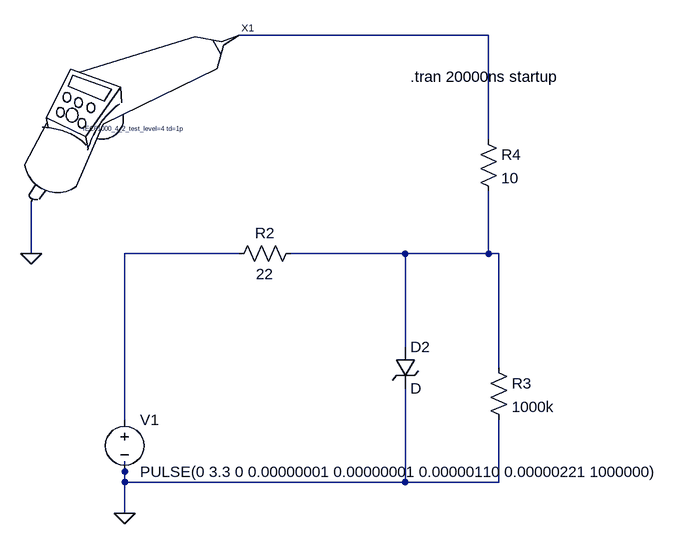
[diagram p0: schematic Draft1.asc]
Draft1.asc, the LTspice schematic file:
Version 4.1
SHEET 1 1024 852
WIRE 688 64 304 64
WIRE 688 224 688 64
WIRE -16 400 -16 320
WIRE 304 400 128 400
WIRE 560 400 384 400
WIRE 688 400 688 304
WIRE 688 400 560 400
WIRE 704 400 688 400
WIRE 560 544 560 400
WIRE 704 576 704 400
WIRE 128 656 128 400
WIRE 128 736 128 720
WIRE 128 752 128 736
WIRE 560 752 560 608
WIRE 560 752 128 752
WIRE 704 752 704 656
WIRE 704 752 560 752
WIRE 128 800 128 752
FLAG -16 400 0
FLAG 128 800 0
SYMBOL ESD模型\\1818be98-41c7-4d63-a15d-34b865506851\\IEC61000-4-2_ESD_Generator 64 208 R0
WINDOW 39 0 0 Left 0
SYMATTR InstName X1
SYMATTR SpiceLine IEC61000_4_2_test_level=4 td=1p
SYMBOL voltage 128 640 R0
WINDOW 123 0 0 Left 0
WINDOW 39 0 0 Left 0
SYMATTR InstName V1
SYMATTR Value PULSE(0 3.3 0 0.00000001 0.00000001 0.00000110 0.00000221 1000000)
SYMBOL res 400 384 R90
WINDOW 0 0 56 VBottom 2
WINDOW 3 32 56 VTop 2
SYMATTR InstName R2
SYMATTR Value 22
SYMBOL res 688 560 R0
SYMATTR InstName R3
SYMATTR Value 1000k
SYMBOL res 672 208 R0
SYMATTR InstName R4
SYMATTR Value 10
SYMBOL TVSdiode 544 544 R0
SYMATTR InstName D2
TEXT 568 128 Left 2 !.tran 20000ns startup

The netlist it stands for:
* Draft1.asc
X§X1 N001 0 IEC61000-4-2_ESD_Generator params: IEC61000_4_2_test_level=4 td=1p  ; pins ESD GND
V1 N002 0 PULSE(0 3.3 0 0.00000001 0.00000001 0.00000110 0.00000221 1000000)
R2 N003 N002 22
R3 N003 0 1000k
R4 N001 N003 10
D2 N003 0 D
.model D D
.lib standard.dio
.tran 20000ns startup
.backanno
.end